# EAGLE design v3 (EAGLE 8.2.2)
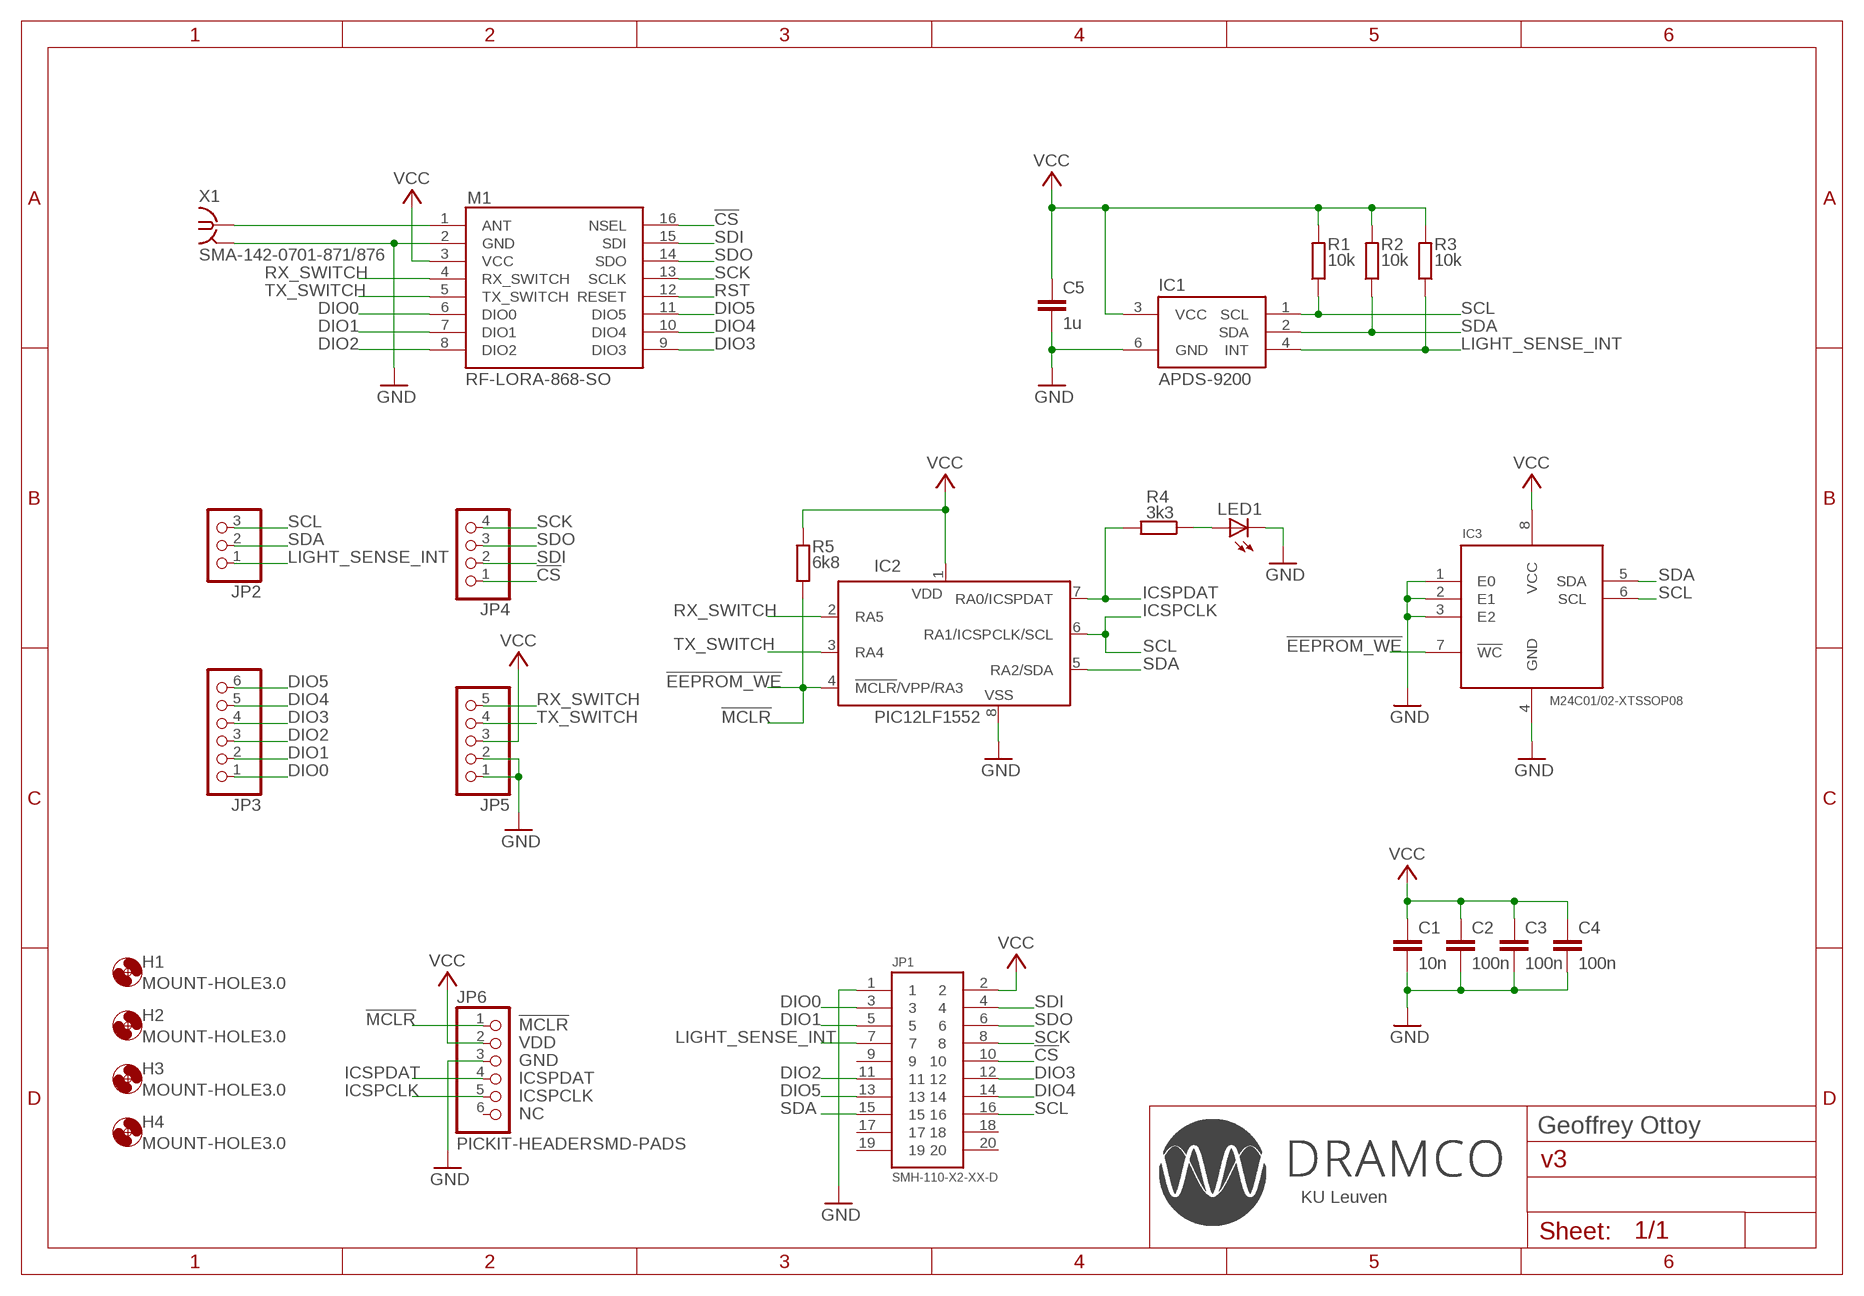
[diagram p0: schematic, sheet 1]

## Parts
C1  10n  C-EUC0805K  [C0805K]
C2  100n  C-EUC0805K  [C0805K]
C3  100n  C-EUC0805K  [C0805K]
C4  100n  C-EUC0805K  [C0805K]
C5  1u  C-EUC0805K  [C0805K]
H1  MOUNT-HOLE3.0  [3,0]
H2  MOUNT-HOLE3.0  [3,0]
H3  MOUNT-HOLE3.0  [3,0]
H4  MOUNT-HOLE3.0  [3,0]
IC1  APDS-9200  [APDS-9200]
IC2  PIC12LF1552  [MSOP8]
IC3  M24C01/02-XTSSOP08  [TSSOP08]
JP1  SMH-110-X2-XX-D  [SMH-110-X2-XX-D]
JP2  PINHD-1X3  [1X03]
JP3  PINHD-1X6  [1X06]
JP4  PINHD-1X4  [1X04]
JP5  PINHD-1X5  [1X05]
JP6  PICKIT-HEADERSMD-PADS  [1X06/SMD]
LED1  LEDCHIP-LED0805  [CHIP-LED0805]
M1  RF-LORA-868-SO  [RF-LORA-868-SO]
R1  10k  R-EU_M0805  [M0805]
R2  10k  R-EU_M0805  [M0805]
R3  10k  R-EU_M0805  [M0805]
R4  3k3  R-EU_M0805  [M0805]
R5  6k8  R-EU_M0805  [M0805]
X1  SMA-142-0701-871/876  [J502-ND-142-0701-871/876]

## Nets
!CS: JP1.10 JP4.1 M1.16(NSEL)
!MCLR: IC2.4(!MCLR!/VPP/RA3) IC3.7(!WC) JP6.1 R5.1
ANT: M1.1(ANT) X1.1
DIO0: JP1.3 JP3.1 M1.6(DIO0)
DIO1: JP1.5 JP3.2 M1.7(DIO1)
DIO2: JP1.11 JP3.3 M1.8(DIO2)
DIO3: JP1.12 JP3.4 M1.9(DIO3)
DIO4: JP1.14 JP3.5 M1.10(DIO4)
DIO5: JP1.13 JP3.6 M1.11(DIO5)
GND: C1.2 C2.2 C3.2 C4.2 C5.2 IC1.6(GND) IC2.8(VSS) IC3.1(E0) IC3.2(E1) IC3.3(E2) IC3.4(GND) JP1.1 JP5.1 JP5.2 JP6.3 LED1.C M1.2(GND) X1.G@1 X1.G@2 X1.G@3 X1.G@4
ICSPDAT: IC2.7(RA0/ICSPDAT) JP6.4 R4.2
LIGHT_SENSE_INT: IC1.4(INT) JP1.7 JP2.1 R3.1
N$1: LED1.A R4.1
RST: M1.12(RESET)
RX_SWITCH: IC2.2(RA5) JP5.5 M1.4(RX_SWITCH)
SCK: JP1.8 JP4.4 M1.13(SCLK)
SCL: IC1.1(SCL) IC2.6(RA1/ICSPCLK/SCL) IC3.6(SCL) JP1.16 JP2.3 JP6.5 R1.1
SDA: IC1.2(SDA) IC2.5(RA2/SDA) IC3.5(SDA) JP1.15 JP2.2 R2.1
SDI: JP1.4 JP4.2 M1.15(SDI)
SDO: JP1.6 JP4.3 M1.14(SDO)
TX_SWITCH: IC2.3(RA4) JP5.4 M1.5(TX_SWITCH)
VCC: C1.1 C2.1 C3.1 C4.1 C5.1 IC1.3(VCC) IC2.1(VDD) IC3.8(VCC) JP1.2 JP5.3 JP6.2 M1.3(VCC) R1.2 R2.2 R3.2 R5.2
Unconnected: JP1.9 JP1.17 JP1.18 JP1.19 JP1.20 JP6.6

## Notes on the sheet
- ICSPCLK
- !EEPROM_WE
- !EEPROM_WE
- ICSPCLK
- Geoffrey Ottoy
- KU Leuven

## Library data of the parts
C1-C5 = rcl:C-EU: CAPACITOR, European symbol
H1-H4 = holes:MOUNT-HOLE: MOUNTING HOLE with drill center marker
IC1 = project:APDS-9200
IC2 = project:PIC12LF1552
IC3 = project:M24C01/02-X
JP1 = project:SMH-110-X2-XX-D
JP2 = pinhead:PINHD-1X3: PIN HEADER
JP3 = pinhead:PINHD-1X6: PIN HEADER
JP4 = pinhead:PINHD-1X4: PIN HEADER
JP5 = pinhead:PINHD-1X5: PIN HEADER
JP6 = project:PICKIT-HEADER
LED1 = led:LED: LED OSRAM: - CHIPLED LG R971, LG N971, LY N971, LG Q971, LY Q971, LO R971, LY R971 LH N974, LH R974 LS Q976, LO Q976, LY Q976 LO Q996 - Hyper CHIPLED LW Q18S LB Q993, LB Q99A, LB R99A - SideLED LS A670, LO A670, LY A670, LG A670, LP A670 LB A673, LV A673, LT A673, LW A673 LH A674 LY A675 LS A676, LA A676, LO A676, LY A676, LW A676 LS A679, LY A679, LG A679 - Hyper Micro SIDELED® LS Y876, LA Y876, LO Y876, LY Y876 LT Y87S - SmartLED LW L88C, LW L88S LB L89C, LB L89S, LG L890 LS L89K, LO L89K, LY L89K LS L896, LA L896, LO L896, LY L896 - TOPLED LS T670, LO T670, LY T670, LG T670, LP T670 LSG T670, LSP T670, LSY T670, LOP T670, LYG T670 LG T671, LOG T671, LSG T671 LB T673, LV T673, LT T673, LW T673 LH T674 LS T676, LA T676, LO T676, LY T676, LB T676, LH T676, LSB T676, LW T676 LB T67C, LV T67C, LT T67C, LS T67K, LO T67K, LY T67K, LW E67C LS E67B, LA E67B, LO E67B, LY E67B, LB E67C, LV E67C, LT E67C LW T67C LS T679, LY T679, LG T679 LS T770, LO T770, LY T770, LG T770, LP T770 LB T773, LV T773, LT T773, LW T773 LH T774 LS E675, LA E675, LY E675, LS T675 LS T776, LA T776, LO T776, LY T776, LB T776 LHGB T686 LT T68C, LB T68C - Hyper Mini TOPLED® LB M676 - Mini TOPLED Santana® LG M470 LS M47K, LO M47K, LY M47K Source: http://www.osram.convergy.de LUXEON: - LUMILED® LXK2-PW12-R00, LXK2-PW12-S00, LXK2-PW14-U00, LXK2-PW14-V00 LXK2-PM12-R00, LXK2-PM12-S00, LXK2-PM14-U00 LXK2-PE12-Q00, LXK2-PE12-R00, LXK2-PE12-S00, LXK2-PE14-T00, LXK2-PE14-U00 LXK2-PB12-K00, LXK2-PB12-L00, LXK2-PB12-M00, LXK2-PB14-N00, LXK2-PB14-P00, LXK2-PB14-Q00 LXK2-PR12-L00, LXK2-PR12-M00, LXK2-PR14-Q00, LXK2-PR14-R00 LXK2-PD12-Q00, LXK2-PD12-R00, LXK2-PD12-S00 LXK2-PH12-R00, LXK2-PH12-S00 LXK2-PL12-P00, LXK2-PL12-Q00, LXK2-PL12-R00 Source: www.luxeon.com KINGBRIGHT: KA-3528ASYC Source: www.kingbright.com
M1 = project:RF-LORA-868-SO
R1-R5 = rcl:R-EU_: RESISTOR, European symbol
X1 = con-coax:SMA-: SMA 50 Ohm End Launch Jack Receptacle - Round Contact Johnson Components Source: www.johnsoncomponents.com .. J502-ND.pdf; MF: JOHNSON COMPONENTS; MPN: 142-0701-871; OC_FARNELL: 1339835; OC_NEWARK: 91B6105

## Board
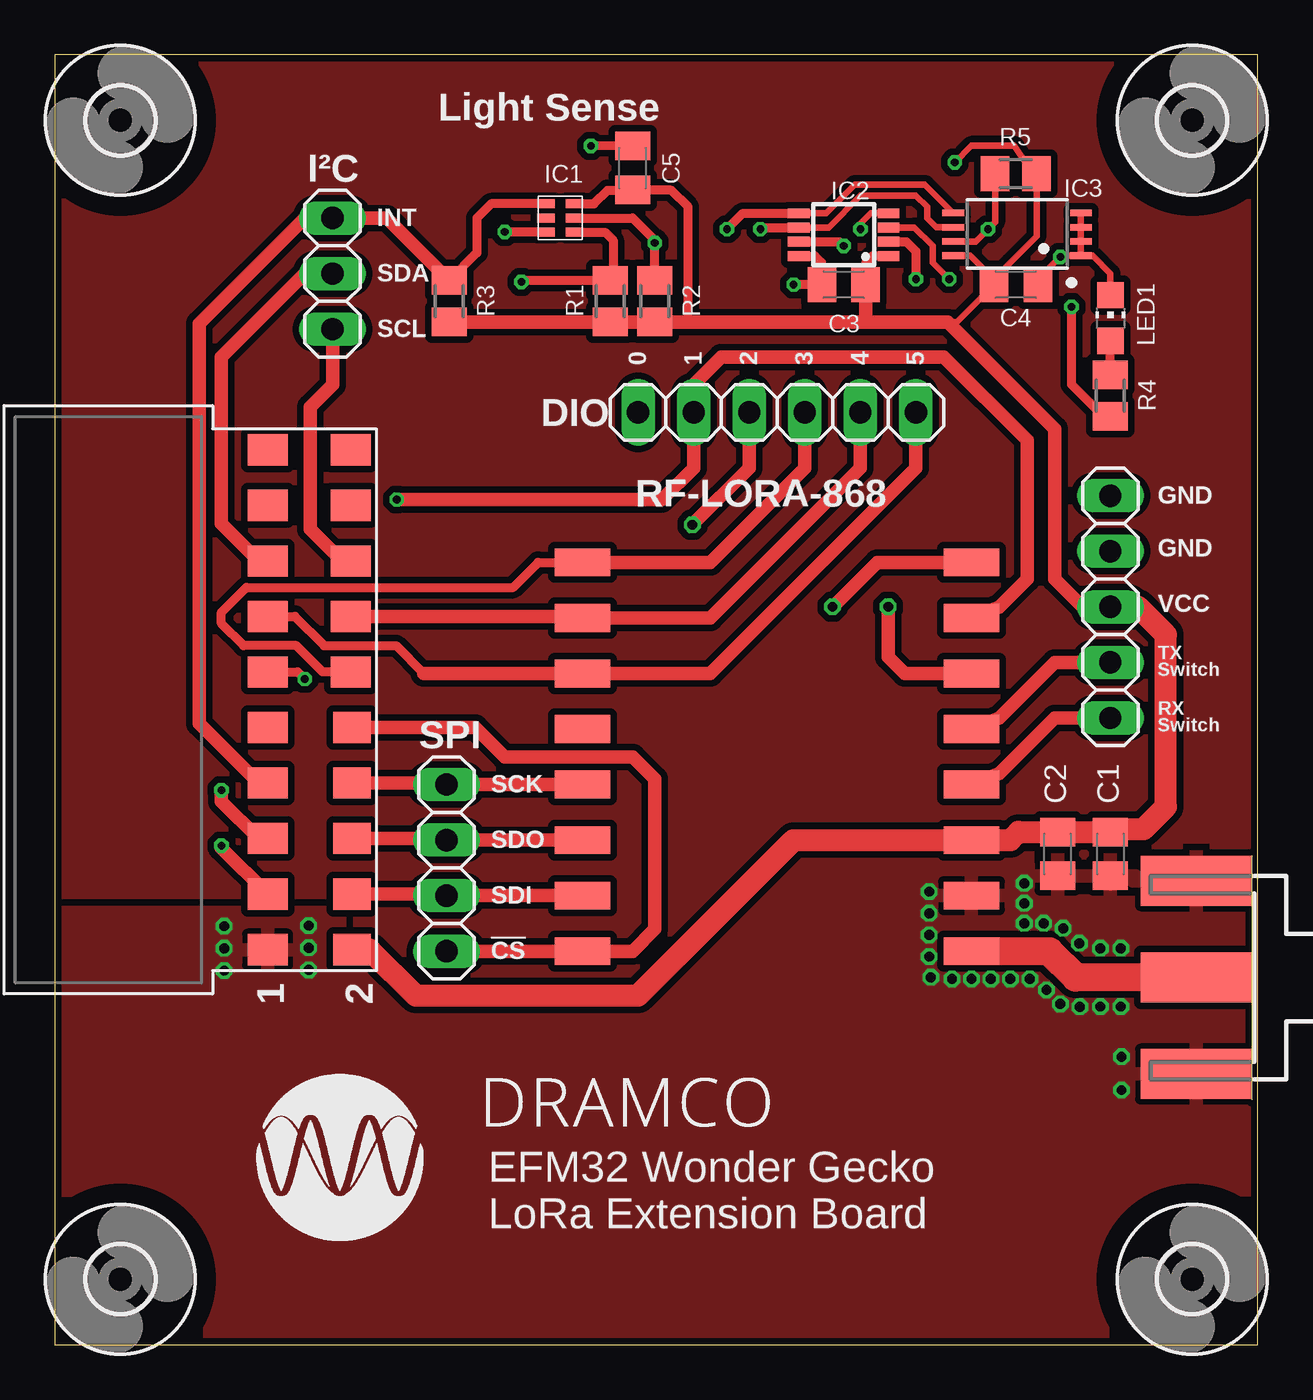
[diagram p1: board, top side]
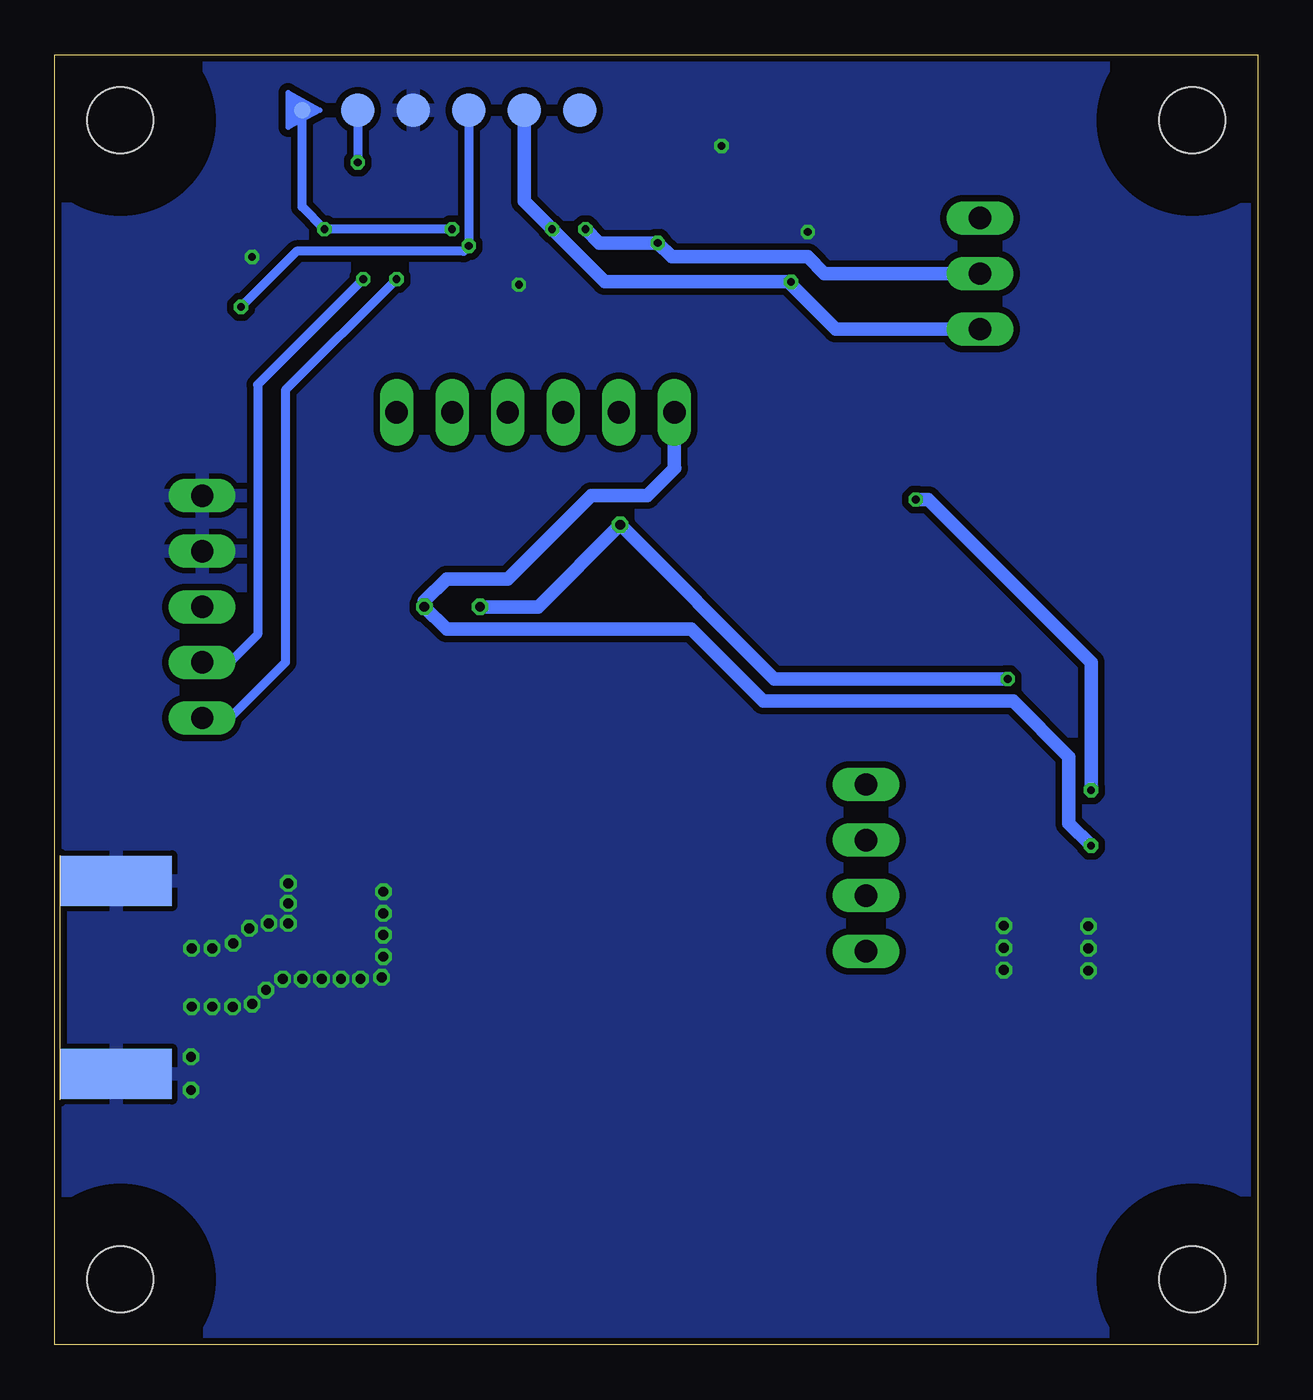
[diagram p2: board, bottom side, seen from below]

Size 55 x 59 mm. Coordinates in mm from the lower left corner, seen from the top.
Outline: 0,0 55,0 55,59 0,59 0,0
Copper layers (1*16): Top 0.035mm / dielectric 1.5mm / Bottom 0.035mm
Design rules "SeeedStudio_2layer_DRU_no_angle_20140221-1": minimum track width 6mil, minimum drill 12mil, track to track 6mil, track to pad 6mil, pad to pad 6mil, via to via 6mil, smd to smd 0mil, copper to edge 10mil, drill to drill 10mil, minimum pad ring 10mil, minimum via ring 6mil, stop-mask expansion 2mil, vias tented up to drill 100mil, thermal gap 10mil

### Footprints (pad centres in the part's own frame; a part is rotated, then mirrored left to right if it is on the bottom)
C0805K = smd 1.3 x 1.6: 1 -1,0; 2 1,0
3,0 = hole 3: 0,0
APDS-9200 = smd 0.406 x 0.813: 1 -0.65,-0.65; 2 0,-0.65; 3 0.65,-0.65; 4 0.65,0.65; 5 0,0.65; 6 -0.65,0.65
MSOP8 = smd 0.45 x 1: 1 -0.975,-2.05; 2 -0.325,-2.05; 3 0.325,-2.05; 4 0.975,-2.05; 5 0.975,2.05; 6 0.325,2.05; 7 -0.325,2.05; 8 -0.975,2.05
TSSOP08 = smd 0.305 x 0.991: 1 -0.961,-2.718; 2 -0.311,-2.718; 3 0.339,-2.718; 4 0.989,-2.718; 5 0.989,3.118; 6 0.339,3.118; 7 -0.311,3.118; 8 -0.961,3.118
SMH-110-X2-XX-D = smd 1.422 x 1.829: 1 11.43,-1.27; 3 8.89,-1.27; 5 6.35,-1.27; 7 3.81,-1.27; 9 1.27,-1.27; 11 -1.27,-1.27; 12 -1.27,2.54; 13 -3.81,-1.27; 14 -3.81,2.54; 15 -6.35,-1.27; 16 -6.35,2.54; 17 -8.89,-1.27; 18 -8.89,2.54; 19 -11.43,-1.27; 20 -11.43,2.54 | smd 1.422 x 1.727: 2 11.43,2.591; 4 8.89,2.591; 6 6.35,2.591; 8 3.81,2.591; 10 1.27,2.591
1X03 = drill 1.016 long: 1 -2.54,0; 2 0,0; 3 2.54,0
1X06 = drill 1.016 long: 1 -6.35,0; 2 -3.81,0; 3 -1.27,0; 4 1.27,0; 5 3.81,0; 6 6.35,0
1X04 = drill 1.016 long: 1 -3.81,0; 2 -1.27,0; 3 1.27,0; 4 3.81,0
1X05 = drill 1.016 long: 1 -5.08,0; 2 -2.54,0; 3 0,0; 4 2.54,0; 5 5.08,0
1X06/SMD = smd 0.762 x 0.762: 1 -6.35,0 | smd 1.524 x 1.524: 2 -3.81,0; 3 -1.27,0; 4 1.27,0; 5 3.81,0; 6 6.35,0
CHIP-LED0805 = smd 1.2 x 1.2: A 0,-1.05; C 0,1.05
RF-LORA-868-SO = smd 2.54 x 1.27: 1 -8.89,8.89; 2 -8.89,6.35; 3 -8.89,3.81; 4 -8.89,1.27; 5 -8.89,-1.27; 6 -8.89,-3.81; 7 -8.89,-6.35; 8 -8.89,-8.89; 9 8.89,-8.89; 10 8.89,-6.35; 11 8.89,-3.81; 12 8.89,-1.27; 13 8.89,1.27; 14 8.89,3.81; 15 8.89,6.35; 16 8.89,8.89
M0805 = smd 1.3 x 1.6: 1 -0.95,0; 2 0.95,0
J502-ND-142-0701-871/876 = smd 5.08 x 2.286: 1 2.565,0; G@1 2.565,4.42; G@2 2.565,-4.42 | smd 5.08 x 2.286 bottom: G@3 2.565,4.42; G@4 2.565,-4.42

### Placement (x,y rotation side)
C1  48.26,22.45 270 top
C2  45.85,22.45 270 top
C3  36.07,48.48 180 top
C4  43.94,48.48 0 top
C5  26.42,53.82 90 top
H1  3,3 0 top
H2  52,3 0 top
H3  52,56 0 top
H4  3,56 0 top
IC1  23.11,51.53 90 top
IC2  36.07,50.77 90 top
IC3  44.2,50.77 90 top
JP1  11,29.5 270 top
JP2  12.7,48.99 270 top
JP3  33.02,42.64 0 top
JP4  17.91,21.81 90 top
JP5  48.26,33.75 270 top
JP6  37.34,56.47 0 bottom
LED1  48.26,46.96 0 top
M1  33.02,26.89 180 top
R1  25.4,47.72 270 top
R2  27.43,47.72 270 top
R3  18.03,47.72 270 top
R4  48.26,43.4 270 top
R5  43.94,53.56 0 top
X1  54.75,16.8 180 top

### Tracks (layer width: path | path; a pad name or v marks a point on that pad's centre or on a via)
!CS
  Top 0.61: JP4.1 M1.16 26.42,18 27.43,19.02 27.43,25.88 26.42,26.89 20.57,26.89 19.24,28.23 JP1.10
!MCLR  (via drill 0.35)
  Top 0.305: IC2.4 37.3,51.74 36.83,51.28 v36.83,51.02 | IC3.7 42.11,50.46 v42.67,51.02 42.99,51.34 R5.1
  Bottom 0.406: v36.83,51.02 v42.67,51.02 43.69,52.04 JP6.1
ANT
  Top 1.27: M1.1 45.47,18 46.67,16.8 X1.1
DIO0  (via drill 0.35, 0.45)
  Top 0.406: 7.62,22.72 v7.62,22.83
  Top 0.61: 9.33,20.61 JP1.3 7.62,22.72 | M1.6 38.86,30.7 38.1,31.46 v38.1,33.75
  Bottom 0.61: JP3.1 26.67,40.1 26.66,40.09 27.92,38.83 30.48,38.83 34.29,35.02 37.08,35.02 38.1,34 v38.1,33.75 37.08,32.73 25.91,32.73 22.61,29.43 11.18,29.43 8.64,26.89 8.64,23.84 v7.62,22.83
DIO1  (via drill 0.35)
  Top 0.406: JP1.5 9.33,23.15
  Top 0.61: v15.64,38.65 27.76,38.65 29.21,40.1 JP3.2 29.21,43.91 30.48,45.18 40.64,45.18 44.45,41.37 44.45,35.02 43.18,33.75 M1.7 | 9.33,23.15 7.62,24.86 v7.62,25.37
  Bottom 0.61: v15.64,38.65 15.06,38.65 7.62,31.21 v7.62,25.37
DIO2  (via drill 0.35, 0.45)
  Top 0.406: JP1.11 11.11,30.77 v11.43,30.45
  Top 0.61: JP3.3 31.75,40.1 v29.15,37.5 | M1.8 37.59,35.78 v35.56,33.75
  Bottom 0.61: v35.56,33.75 32.9,33.75 v29.15,37.5 22.1,30.45 v11.43,30.45
DIO3
  Top 0.406: JP1.12 12.25,30.77 11.05,31.97 8.64,31.97 7.62,32.99 7.62,33.5 8.76,34.64 20.95,34.64 22.1,35.78 M1.9
  Top 0.61: JP3.4 34.29,40.1 29.97,35.78 M1.9 24.06,35.85
DIO4
  Top 0.61: JP3.5 36.83,40.1 29.97,33.24 M1.10 24.06,33.31 JP1.14
DIO5
  Top 0.406: JP1.13 10.98,33.31 12.32,31.97 15.6,31.97 16.87,30.7
  Top 0.61: JP3.6 39.37,40.1 29.97,30.7 M1.11 16.87,30.7
GND  (via drill 0.35, 0.45)
  Top 0.305: IC3.4 IC3.3 IC3.2 IC3.1 | C4.2 44.94,48.72 v45.97,49.75 46.03,49.81 IC3.1 | LED1.C 48.26,48.99 47.44,49.81 IC3.1
  Top 0.406: IC1.6 20.57,50.88 v20.57,50.9 | C5.2 26.27,54.82 v24.51,54.83 | v33.78,48.48 C3.2 35.05,48.5 35.05,49.5 34.76,49.79 IC2.8
  Top 0.61: 48.26,21.07 C1.2
  other vias: 45.97,15.59 7.75,19.14 46.86,15.46 7.75,18.13 11.61,18.15 47.8,18.13 46.84,18.36 46.1,19.04 44.58,16.73 45.34,16.22 44.32,20.19 39.98,20.72 39.98,19.73 39.98,18.74 39.98,17.75 41.91,16.73 42.8,16.73 43.69,16.73 7.75,17.11 11.61,19.17 11.61,17.14 48.74,18.13 48.77,13.18 48.77,11.65 47.8,15.47 41.02,16.73 40.06,16.81 48.74,15.47 44.32,19.27 45.21,19.27 44.32,21.1
  pour Bottom (isolate 0.305): 0,58.61 54.61,58.61 54.61,0 0,0
  pour Top (isolate 0.305): 0,19.78 12.7,19.78 16.51,15.97 27.94,15.97 34.29,22.32 54.61,22.32 54.61,0 0,0
ICSPDAT  (via drill 0.35)
  Top 0.305: 48.21,42.45 R4.2
  Top 0.406: IC2.7 35.88,50.44 v36.07,50.26 | 48.21,42.45 47.82,42.58 47.31,43.09 46.48,43.92 v46.48,47.47
  Bottom 0.406: JP6.4 v36.07,50.26 36.32,50.01 43.94,50.01 v46.48,47.47
LIGHT_SENSE_INT
  Top 0.406: R3.1 19.3,49.94 19.3,51.53 19.95,52.18 IC1.4
  Top 0.61: R3.1 15.17,51.53 JP2.1 11.43,51.53 6.6,46.7 6.6,28.42 9.33,25.69 JP1.7
N$1
  Top 0.406: R4.1 LED1.A
RX_SWITCH  (via drill 0.35)
  Top 0.406: IC2.2 38.93,50.44 39.37,50.01 v39.37,48.74
  Top 0.61: M1.4 43.18,26.13 45.72,28.67 JP5.5
  Bottom 0.406: v39.37,48.74 44.45,43.66 44.45,31.21 46.99,28.67 JP5.5
SCK
  Top 0.61: JP1.8 17.85,25.69 JP4.4 M1.13
SCL  (via drill 0.35)
  Top 0.305: IC2.6 35.38,51.09 36.83,52.55 39.37,52.55 39.88,52.04 39.88,51.53 40.3,51.11 IC3.6
  Top 0.406: IC1.1 25.16,50.88 25.53,50.51 25.53,48.8 R1.1 21.4,48.67 v21.34,48.61 | IC2.6 32.33,51.09 v32.26,51.02 | JP1.16 13.14,35.85
  Top 0.61: 13.14,35.85 11.68,37.31 11.68,42.89 12.7,43.91 JP2.3
  Bottom 0.406: 21.34,48.48 v21.34,48.61
  Bottom 0.61: JP2.3 19.3,46.45 21.34,48.48 | v21.34,48.61 29.84,48.61 v32.26,51.02 33.53,52.29 JP6.5
SDA  (via drill 0.35)
  Top 0.305: IC2.5 35.27,51.74 36.58,53.05 39.78,53.05 IC3.5
  Top 0.406: IC1.2 26.42,51.53 27.43,50.51 v27.43,50.39 R2.1 | IC2.5 31.45,51.74 v30.73,51.02 | JP1.15 9.33,35.85
  Top 0.61: 9.33,35.85 7.62,37.56 7.62,45.18 11.43,48.99 JP2.2
  Bottom 0.61: JP2.2 19.81,48.99 20.57,49.75 26.8,49.75 v27.43,50.39 30.1,50.39 v30.73,51.02
SDI
  Top 0.61: JP1.4 17.85,20.61 JP4.2 M1.15
SDO
  Top 0.61: JP1.6 17.85,23.15 JP4.3 M1.14
TEST
  pour Top (isolate 0.305, rank 2): 0,59 0,16 55,16 55,59
TX_SWITCH  (via drill 0.35)
  Top 0.305: IC2.3 39.3,51.09 40.13,50.26 40.13,49.5 v40.89,48.74
  Top 0.61: M1.5 43.18,28.67 45.72,31.21 JP5.4
  Bottom 0.406: v40.89,48.74 45.72,43.91 45.72,32.48 46.99,31.21 JP5.4
VCC  (via drill 0.35)
  Top 0.305: IC3.8 41.85,49.81 42.94,48.73 | 42.94,48.73 42.94,48.72 C4.1 41.23,46.77 40.83,46.77 | 42.94,48.73 43.69,49.48 43.69,49.5 44.89,50.7 R5.2 44.89,53.31 43.88,54.83 41.91,54.83 v41.15,54.07
  Top 0.406: IC1.3 24.65,52.18 25.27,52.8 26.4,52.8 C5.1 26.43,52.8 28.19,52.8 28.96,52.04 28.96,46.7 31.18,46.77 R1.2 | IC2.1 37.38,49.79 37.08,49.5 37.08,48.5 C3.1
  Top 0.61: 47.99,23.59 C1.1 48.26,23.59 | C2.1 45.72,23.56 45.75,23.59 | R3.2 R1.2 R2.2 37.08,46.77 | JP5.3 46.99,33.75 45.72,35.02 45.72,41.88 40.83,46.77 37.08,46.77 | 37.08,46.77 37.08,48.5
  Top 1.016: JP5.3 49.53,33.75 50.8,32.48 50.8,24.61 49.78,23.59 48.26,23.59 | JP1.2 14.41,18.07 16.51,15.97 26.67,15.97 33.78,23.08 M1.3 43.69,23.08 44.07,23.46 45.83,23.46 C2.1 C1.1
  Bottom 0.406: JP6.2 v41.15,54.07

### Text on the board
tSilkscreen: Light Sense | I²C | INT | SDA | SCL | 0 | 1 | 2 | 3 | 4 | 5 | DIO | RF-LORA-868 | GND | GND | VCC | Switch | TX | RX | Switch | SPI | SCK | SDO | SDI | !CS | EFM32 Wonder Gecko / LoRa Extension Board
101bmp: Designed by: / Geoffrey Ottoy, Gilles Callebaut, / Guus Leenders | KU Leuven - Technology Campus Ghent | DRAMCO research group | EFM32 Wonder Gecko | LoRa Extension Board (v3.0)